# EAGLE schematic goodthopter12 (EAGLE 6.3)
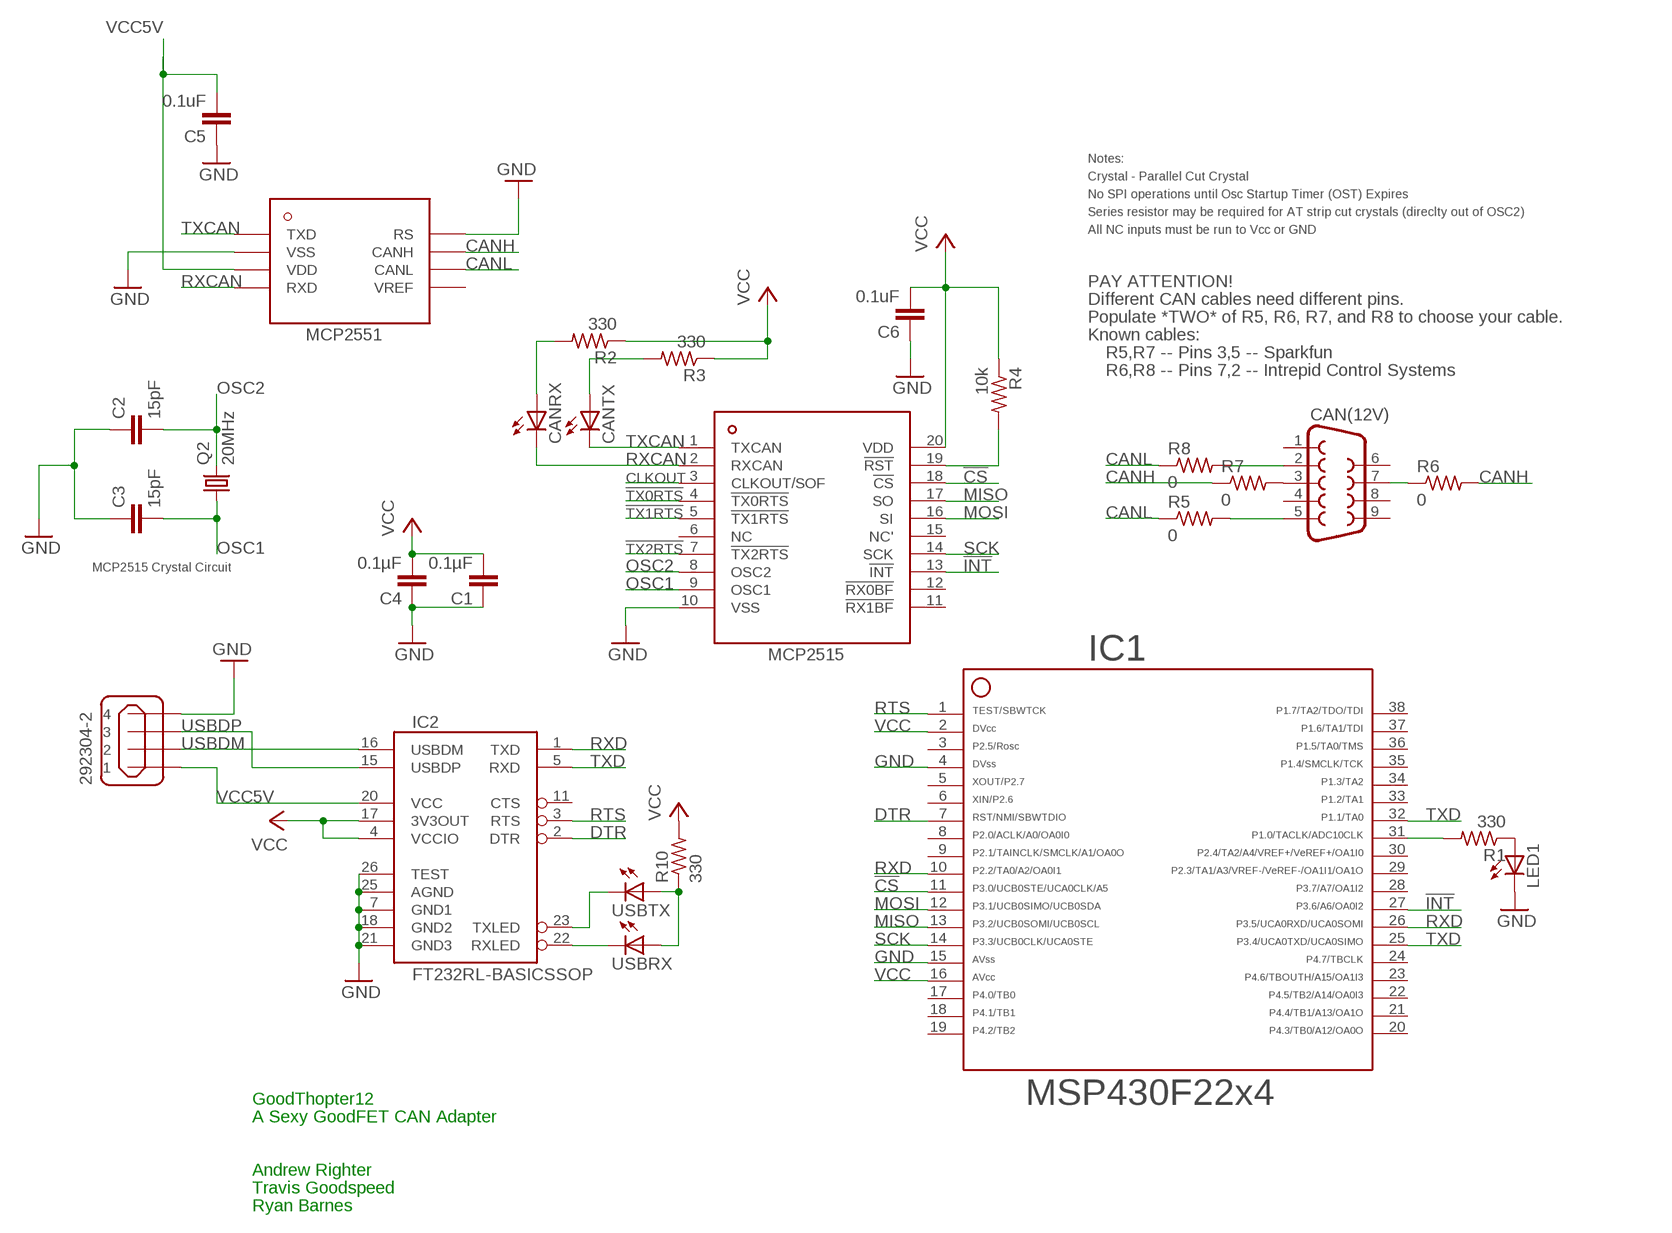
[diagram p0: schematic, sheet 1]

## Parts
292304-2  MINI-USB_4P-292304-2  [85-32004-10X]
C1  0.1µF  C-EUC0603  [C0603]
C2  15pF  C-EUC0603  [C0603]
C3  15pF  C-EUC0603  [C0603]
C4  0.1µF  C-EUC0603  [C0603]
C5  0.1uF  C-EUC0603  [C0603]
C6  0.1uF  C-EUC0603  [C0603]
CAN(12V)  DB9MALE  [DB9_MALE]
CANRX  LEDCHIP-LED0603  [CHIP-LED0603]
CANTX  LEDCHIP-LED0603  [CHIP-LED0603]
IC1  F22X4---DA38  [DA38]
IC2  FT232RL-BASICSSOP  [SSOP28DB]
LED1  LEDCHIP-LED0603  [CHIP-LED0603]
Q2  20MHz  CRYSTALHC49UP  [HC49UP]
R1  330  R-US_R0603  [R0603]
R2  330  R-US_R0603  [R0603]
R3  330  R-US_R0603  [R0603]
R4  10k  R-US_R0603  [R0603]
R5  0  R-US_R0603  [R0603]
R6  0  R-US_R0603  [R0603]
R7  0  R-US_R0603  [R0603]
R8  0  R-US_R0603  [R0603]
R10  330  R-US_R0603  [R0603]
U$1  MCP2515  [TSSOP20]
U$2  MCP2551  [SOIC-8]
USBRX  LEDCHIP-LED0603  [CHIP-LED0603]
USBTX  LEDCHIP-LED0603  [CHIP-LED0603]

## Nets
!CS: IC1.11 U$1.18(!CS)
!INT: IC1.27 U$1.13(!INT)
!TX0RTS: U$1.4(!TX0RTS)
!TX1RTS: U$1.5(!TX1RTS)
!TX2RTS: U$1.7(!TX2RTS)
CANH: R6.2 R7.1 U$2.CANH
CANL: R5.1 R8.1 U$2.CANL
CLKOUT: U$1.3(CLKOUT/SOF)
DTR: IC1.7 IC2.2(DTR)
GND: 292304-2.4 C1.1 C2.1 C3.1 C4.1 C5.1 C6.1 IC1.4 IC1.15 IC2.7(GND1) IC2.18(GND2) IC2.21(GND3) IC2.25(AGND) IC2.26(TEST) LED1.C U$1.10(VSS) U$2.RS U$2.VSS
MISO: IC1.13 U$1.17(SO)
MOSI: IC1.12 U$1.16(SI)
N$1: CANRX.A R2.2
N$2: CANTX.A R3.2
N$3: CAN(12V).2 R8.2
N$4: CAN(12V).3 R7.2
N$5: R4.2 U$1.19(!RST)
N$6: IC2.22(RXLED) USBRX.C
N$7: IC2.23(TXLED) USBTX.C
N$8: R10.1 USBRX.A USBTX.A
N$9: IC1.31 R1.2
N$10: LED1.A R1.1
N$11: CAN(12V).5 R5.2
N$12: CAN(12V).7 R6.1
OSC1: C3.2 Q2.1 U$1.9(OSC1)
OSC2: C2.2 Q2.2 U$1.8(OSC2)
RTS: IC1.1 IC2.3(RTS)
RXCAN: CANRX.C U$1.2(RXCAN) U$2.RXD
RXD: IC1.10 IC1.26 IC2.1(TXD)
SCK: IC1.14 U$1.14(SCK)
TXCAN: CANTX.C U$1.1(TXCAN) U$2.TXD
TXD: IC1.25 IC1.32 IC2.5(RXD)
USBDM: 292304-2.2 IC2.16(USBDM)
USBDP: 292304-2.3 IC2.15(USBDP)
VCC: C1.2 C4.2 C6.2 IC1.2 IC1.16 IC2.4(VCCIO) IC2.17(3V3OUT) R2.1 R3.1 R4.1 R10.2 U$1.20(VDD)
VCC5V: 292304-2.1 C5.2 IC2.20(VCC) U$2.VDD
Unconnected: CAN(12V).1 CAN(12V).4 CAN(12V).6 CAN(12V).8 CAN(12V).9 IC1.3 IC1.5 IC1.6 IC1.8 IC1.9 IC1.17 IC1.18 IC1.19 IC1.20 IC1.21 IC1.22 IC1.23 IC1.24 IC1.28 IC1.29 IC1.30 IC1.33 IC1.34 IC1.35 IC1.36 IC1.37 IC1.38 IC2.11(CTS) U$1.6(NC) U$1.11(!RX1BF) U$1.12(!RX0BF) U$1.15(NC') U$2.VREF

## Notes on the sheet
- Notes:
- Crystal - Parallel Cut Crystal
- No SPI operations until Osc Startup Timer (OST) Expires
- Series resistor may be required for AT strip cut crystals (direclty out of OSC2)
- All NC inputs must be run to Vcc or GND
- PAY ATTENTION!
- Different CAN cables need different pins.
- Populate *TWO* of R5, R6, R7, and R8 to choose your cable.
- Known cables:
- R5,R7 -- Pins 3,5 -- Sparkfun
- R6,R8 -- Pins 7,2 -- Intrepid Control Systems
- MCP2515 Crystal Circuit
- 292304-2
- GoodThopter12
- A Sexy GoodFET CAN Adapter
- Andrew Righter
- Travis Goodspeed
- Ryan Barnes

## Library data of the parts
292304-2 = USB-TYPE-B:MINI-USB_4P-: MINI USB 4 Pol. Source: www.cypressindustries.com; OC_FARNELL: unknown; OC_NEWARK: unknown
C1-C6 = rcl:C-EU: CAPACITOR, European symbol
CAN(12V) = SparkFun-Connectors:DB9: DB9 Connector Standard DB9 (D-Sub 9) serial connector. Can be used for CAN bus as well as RS485 and RS232. Footprint production proven. Spark Fun Electronics SKU : PRT-00429
CANRX CANTX LED1 USBRX USBTX = led:LED: LED OSRAM: - CHIPLED LG R971, LG N971, LY N971, LG Q971, LY Q971, LO R971, LY R971 LH N974, LH R974 LS Q976, LO Q976, LY Q976 LO Q996 - Hyper CHIPLED LW Q18S LB Q993, LB Q99A, LB R99A - SideLED LS A670, LO A670, LY A670, LG A670, LP A670 LB A673, LV A673, LT A673, LW A673 LH A674 LY A675 LS A676, LA A676, LO A676, LY A676, LW A676 LS A679, LY A679, LG A679 - Hyper Micro SIDELED® LS Y876, LA Y876, LO Y876, LY Y876 LT Y87S - SmartLED LW L88C, LW L88S LB L89C, LB L89S, LG L890 LS L89K, LO L89K, LY L89K LS L896, LA L896, LO L896, LY L896 - TOPLED LS T670, LO T670, LY T670, LG T670, LP T670 LSG T670, LSP T670, LSY T670, LOP T670, LYG T670 LG T671, LOG T671, LSG T671 LB T673, LV T673, LT T673, LW T673 LH T674 LS T676, LA T676, LO T676, LY T676, LB T676, LH T676, LSB T676, LW T676 LB T67C, LV T67C, LT T67C, LS T67K, LO T67K, LY T67K, LW E67C LS E67B, LA E67B, LO E67B, LY E67B, LB E67C, LV E67C, LT E67C LW T67C LS T679, LY T679, LG T679 LS T770, LO T770, LY T770, LG T770, LP T770 LB T773, LV T773, LT T773, LW T773 LH T774 LS E675, LA E675, LY E675, LS T675 LS T776, LA T776, LO T776, LY T776, LB T776 LHGB T686 LT T68C, LB T68C - Hyper Mini TOPLED® LB M676 - Mini TOPLED Santana® LG M470 LS M47K, LO M47K, LY M47K Source: http://www.osram.convergy.de LUXEON: - LUMILED® LXK2-PW12-R00, LXK2-PW12-S00, LXK2-PW14-U00, LXK2-PW14-V00 LXK2-PM12-R00, LXK2-PM12-S00, LXK2-PM14-U00 LXK2-PE12-Q00, LXK2-PE12-R00, LXK2-PE12-S00, LXK2-PE14-T00, LXK2-PE14-U00 LXK2-PB12-K00, LXK2-PB12-L00, LXK2-PB12-M00, LXK2-PB14-N00, LXK2-PB14-P00, LXK2-PB14-Q00 LXK2-PR12-L00, LXK2-PR12-M00, LXK2-PR14-Q00, LXK2-PR14-R00 LXK2-PD12-Q00, LXK2-PD12-R00, LXK2-PD12-S00 LXK2-PH12-R00, LXK2-PH12-S00 LXK2-PL12-P00, LXK2-PL12-Q00, LXK2-PL12-R00 Source: www.luxeon.com KINGBRIGHT: KA-3528ASYC Source: www.kingbright.com
IC1 = TI_MSP430_v13:F22X4---DA38: ***MSP430F22x4***DA38
IC2 = SparkFun:FT232RL-BASIC: USB UART This is the simplified version of the FT232RL unit. Only what you need, nothing you don't. Spark Fun Electronics SKU : COM-00650
Q2 = crystal:CRYSTAL: CRYSTAL; OC_FARNELL: unknown; OC_NEWARK: unknown
R1-R8 R10 = rcl:R-US_: RESISTOR, American symbol
U$1 = MCP2515:MCP2515: Microchip Technology’s MCP2515 is a stand-alone Controller Area Network (CAN) controller that implements the CAN specification, version 2.0B. It is capable of transmitting and receiving both standard and extended data and remote frames. The MCP2515 has two acceptance masks and six acceptance filters that are used to filter out unwanted messages, thereby reducing the host MCUs overhead. The MCP2515 interfaces with microcontrollers (MCUs) via an industry standard Serial Peripheral Interface (SPI).
U$2 = MCP2551:MCP2551: The MCP2551 is a high-speed CAN, fault-tolerant device that serves as the interface between a CAN protocol controller and the physical bus. The MCP2551 provides differential transmit and receive capability for the CAN protocol controller and is fully compatible with the ISO-11898 standard, including 24V requirements. It will operate at speeds of up to 1 Mb/s. Typically, each node in a CAN system must have a device to convert the digital signals generated by a CAN controller to signals suitable for transmission over the bus cabling (differential output). It also provides a buffer between the CAN controller and the high-voltage spikes that can be generated on the CAN bus by outside sources (EMI, ESD, electrical transients, etc.).